# Altium schematic sheet Schematic.SchDoc: STM32F051 Lite Development Board
size A4; Author: LD Stanton; DrawnBy: Lawrence Stanton; Engineer: Lawrence Stanton; Organization: University of Cape Town; Address1: Department of Electrical Engineering; Address2: Rondebosch; Address3: Cape Town; Address4: South Africa 7701; DocumentNumber: 1; Revision: v1.1; SheetNumber: 1; SheetTotal: 1
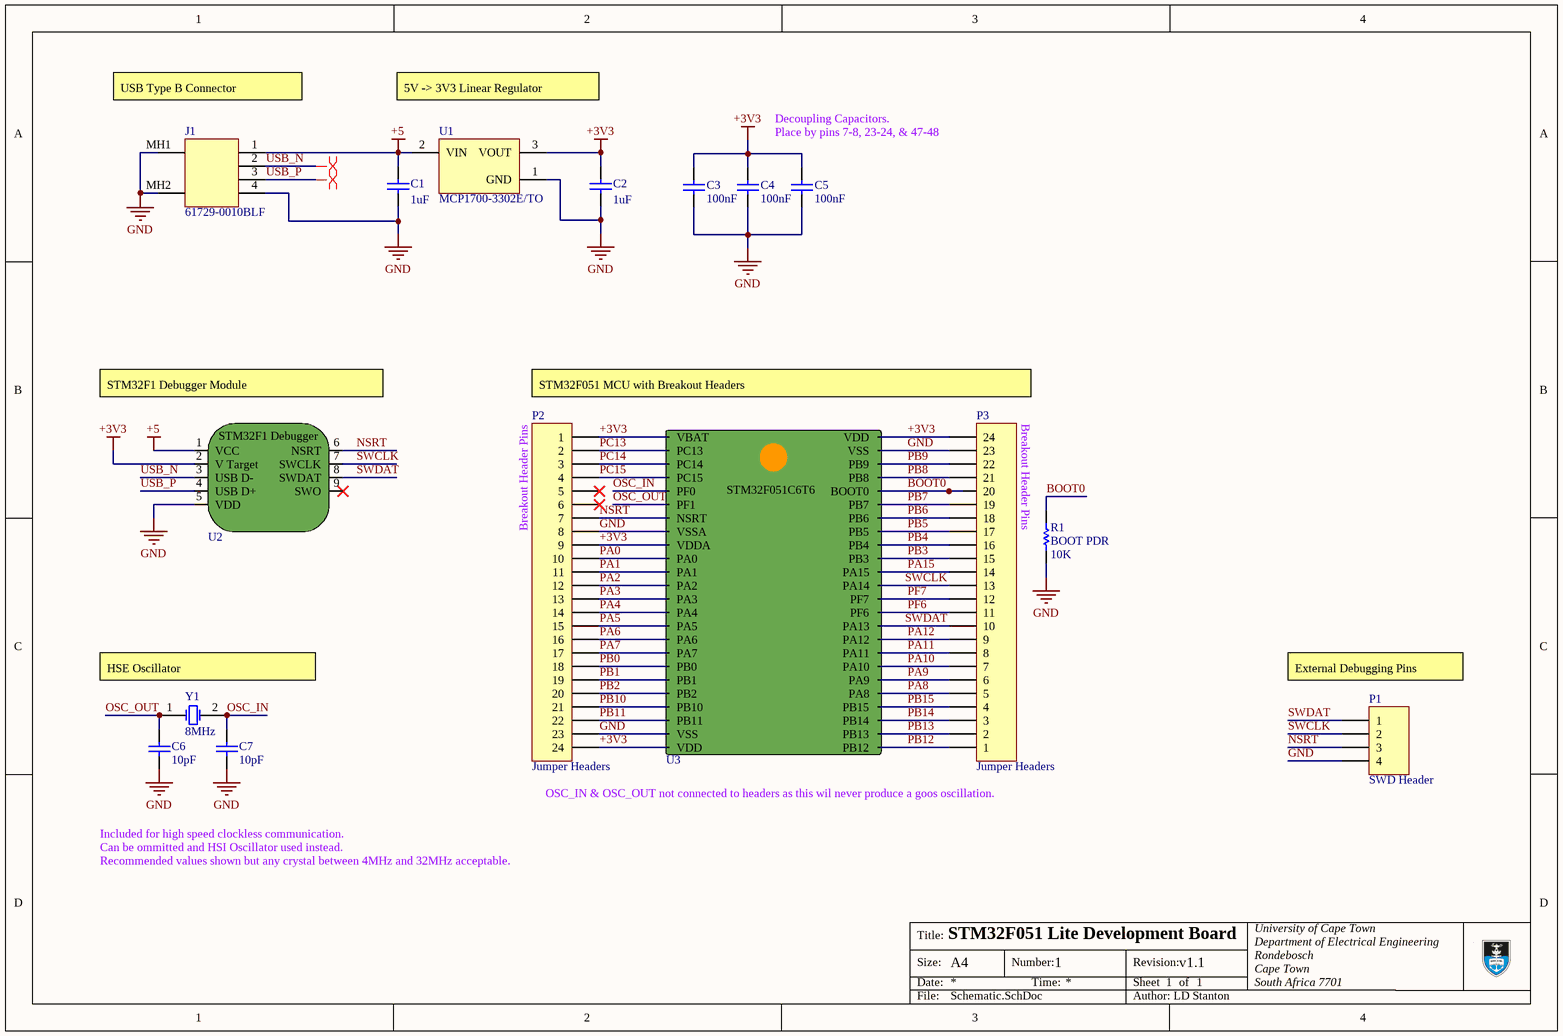
[diagram p0: Schematic.SchDoc]

## Parts
C1  value 1uF  [200mil Capacitor THT]  (hidden comment: Ceramic Capacitor)
C2  value 1uF  [200mil Capacitor THT]  (hidden comment: Ceramic Capacitor)
C3  value 100nF  [100mil Capacitor THT]  (hidden comment: Ceramic Capacitor)
C4  value 100nF  [100mil Capacitor THT]  (hidden comment: Ceramic Capacitor)
C5  value 100nF  [100mil Capacitor THT]  (hidden comment: Ceramic Capacitor)
C6  value 10pF  [100mil Capacitor THT]  (hidden comment: Ceramic Capacitor)
C7  value 10pF  [100mil Capacitor THT]  (hidden comment: Ceramic Capacitor)
J1  61729-0010BLF  [FCI-61729-0010BLF-6_V]
P1  SWD Header  [HDR1X4H]
P2  Jumper Headers  [HDR1X24]
P3  Jumper Headers  [HDR1X24]
R1  BOOT PDR  value 10K  [AXIAL-0.3]
U1  MCP1700-3302E/TO  [TO-92-TO3]
U2  STM32F1 Debugger  [STM Debugger]  (value not drawn)
U3  STM32F051C6T6 Baracuda Breakout  [STM32F051C6T6 Baracuda Breakout]  (value not drawn)
Y1  8MHz  [200mil Flat Quarts Crystal THT]

## Nets
+3V3: C2.1 C3.1 C4.1 C5.1 P2.1 P2.9 P2.24 P3.24 U1.3(VOUT) U2.2(V_Target) U3.1(VBAT) U3.9(VDDA) U3.24(VDD) U3.48(VDD)
+5: C1.1 J1.1 U1.2(VIN) U2.1(VCC)
GND: C1.2 C2.2 C3.2 C4.2 C5.2 C6.2 C7.2 J1.4 J1.MH1 J1.MH2 P1.4 P2.8 P2.23 P3.23 R1.2 U1.1(GND) U2.5(VDD) U3.8(VSSA) U3.23(VSS) U3.47(VSS)
BOOT0: P3.20 R1.1 U3.44(BOOT0)
NSRT: P1.3 P2.7 U2.6(NSRT) U3.7(NSRT)
OSC_IN: C7.1 U3.5(PF0) Y1.2(OSC2)
OSC_OUT: C6.1 U3.6(PF1) Y1.1(OSC1)
PA0: P2.10 U3.10(PA0)
PA1: P2.11 U3.11(PA1)
PA2: P2.12 U3.12(PA2)
PA3: P2.13 U3.13(PA3)
PA4: P2.14 U3.14(PA4)
PA5: P2.15 U3.15(PA5)
PA6: P2.16 U3.16(PA6)
PA7: P2.17 U3.17(PA7)
PA8: P3.5 U3.29(PA8)
PA9: P3.6 U3.30(PA9)
PA10: P3.7 U3.31(PA10)
PA11: P3.8 U3.32(PA11)
PA12: P3.9 U3.33(PA12)
PA15: P3.14 U3.38(PA15)
PB0: P2.18 U3.18(PB0)
PB1: P2.19 U3.19(PB1)
PB2: P2.20 U3.20(PB2)
PB3: P3.15 U3.39(PB3)
PB4: P3.16 U3.40(PB4)
PB5: P3.17 U3.41(PB5)
PB6: P3.18 U3.42(PB6)
PB7: P3.19 U3.43(PB7)
PB8: P3.21 U3.45(PB8)
PB9: P3.22 U3.46(PB9)
PB10: P2.21 U3.21(PB10)
PB11: P2.22 U3.22(PB11)
PB12: P3.1 U3.25(PB12)
PB13: P3.2 U3.26(PB13)
PB14: P3.3 U3.27(PB14)
PB15: P3.4 U3.28(PB15)
PC13: P2.2 U3.2(PC13)
PC14: P2.3 U3.3(PC14)
PC15: P2.4 U3.4(PC15)
PF6: P3.11 U3.35(PF6)
PF7: P3.12 U3.36(PF7)
SWCLK: P1.2 P3.13 U2.7(SWCLK) U3.37(PA14)
SWDAT: P1.1 P3.10 U2.8(SWDAT) U3.34(PA13)
USB_N: J1.2 U2.3(USB_D-)
USB_P: J1.3 U2.4(USB_D+)

Not connected (* = marked no-connect by the designer): P2 5* 6*; U2 9(SWO)*

## Layout directives
differential pair: USB_N, USB_P

## Notes on the sheet
- (near J1) USB Type B Connector
- 5V -> 3V3 Linear Regulator
- Decoupling Capacitors.
- Place by pins 7-8, 23-24, & 47-48
- STM32F1 Debugger Module
- STM32F051 MCU with Breakout Headers
- (near R1) Breakout Header Pins
- (near P2) Breakout Header Pins
- (near Y1) HSE Oscillator
- (near P1) External Debugging Pins
- Included for high speed clockless communication.
- Can be ommitted and HSI Oscillator used instead.
- OSC_IN & OSC_OUT not connected to headers as this wil never produce a goos oscillation.
- Recommended values shown but any crystal between 4MHz and 32MHz acceptable.
- Title:
- Size:
- Date:
- A4
- Number:
- Time:
- Revision:
- Sheet
- of
- File:
- Author:
- (in symbol STM32F051C6T6 Baracuda Breakout) STM32F051C6T6

## Library data of the parts
C1-C7 = Cap: Capacitor; Published: 8-Jun-2000; LatestRevisionDate: 17-Jul-2002; LatestRevisionNote: Re-released for DXP Platform.; PackageReference: RAD-0.3; Publisher: Altium Limited; PackageDescription: Radial Cap, Thru-Hole; 2 Leads; 0.3 in Pin Spacing
J1 = CMP-0397-00002-2: Single USB 2.0, B Type, Right Angle Jack, Through Hole, RoHS, Tube; Manufacturer: FCI Electronics; Number of Contacts: 4; Gender: Receptacle; Specifications: USB 2.0; Connector Type: USB-B; ComponentLink1URL: http://portal.fciconnect.com/; DatasheetVersion: Rev. V; PartNumber: 61729-0010BLF; ComponentLink3Description: Package Specification; PackageDescription: 6-Pin, Through Hole, Body 12.2 x 16 mm; Packing: Tube; ComponentLink2Description: Datasheet; Mounting Technology: Through Hole; PackageReference: 61729-0010BLF; ComponentLink1Description: Manufacturer URL; ComponentLink3URL: http://portal.fciconnect.com/Comergent//fci/drawing/61729.pdf; ComponentLink2URL: http://portal.fciconnect.com/Comergent//fci/drawing/61729.pdf; RoHS: TRUE
P1 = Header 4H: Header, 4-Pin, Right Angle; LatestRevisionDate: 17-Jul-2002; LatestRevisionNote: Re-released for DXP Platform.; Publisher: Altium Limited
P2 P3 = Header 24: Header, 24-Pin; LatestRevisionDate: 17-Jul-2002; LatestRevisionNote: Re-released for DXP Platform.; Publisher: Altium Limited
R1 = Res1: Resistor; Published: 8-Jun-2000; LatestRevisionDate: 17-Jul-2002; LatestRevisionNote: Re-released for DXP Platform.; PackageReference: AXIAL-0.3; Publisher: Altium Limited; PackageDescription: Axial Device, Thru-Hole; 2 Leads; 0.3 in Pin Spacing
U1 = MCP1700-3302E/TO: Low Quiescent Current LDO, 3-Pin TO-92, Extended TemperatureBAG; Published: 29-Jan-2009; DatasheetVersion: revB, Feb-2007; PackageVersion: revBB, Aug-2009; PackageReference: TO-92-TO3; Publisher: Altium Limited; PackageDescription: 3-Lead Plastic Transistor Outline (TO) [TO-92]; Supplier 1: Digi-Key; Supplier Part Number 1: MCP1700-3302E/TO-ND; Supplier 2: Farnell; Supplier Part Number 2: 1296588; ComponentLink1Description: Datasheet; ComponentLink1URL: http://ww1.microchip.com/downloads/en/DeviceDoc/21826b.pdf; ComponentLink2Description: Packaging Specification; ComponentLink2URL: http://www.microchip.com/stellent/groups/techpub_sg/documents/packagingspec/en012702.pdf; ComponentLink3Description: Microchip.com Home; ComponentLink3URL: http://www.microchip.com/
Y1 = XTAL: Crystal Oscillator; Published: 8-Jun-2000; LatestRevisionDate: 17-Jul-2002; LatestRevisionNote: Re-released for DXP Platform.; PackageReference: R38; Publisher: Altium Limited; PackageDescription: Crystal, Thru-Hole; 2 Leads; Body 3.1 x 8.2 mm (Dia.xH)